# Altium schematic sheet Weather_Station_ETH.SCHDOC
size A4; SheetNumber: 0; SheetTotal: 0
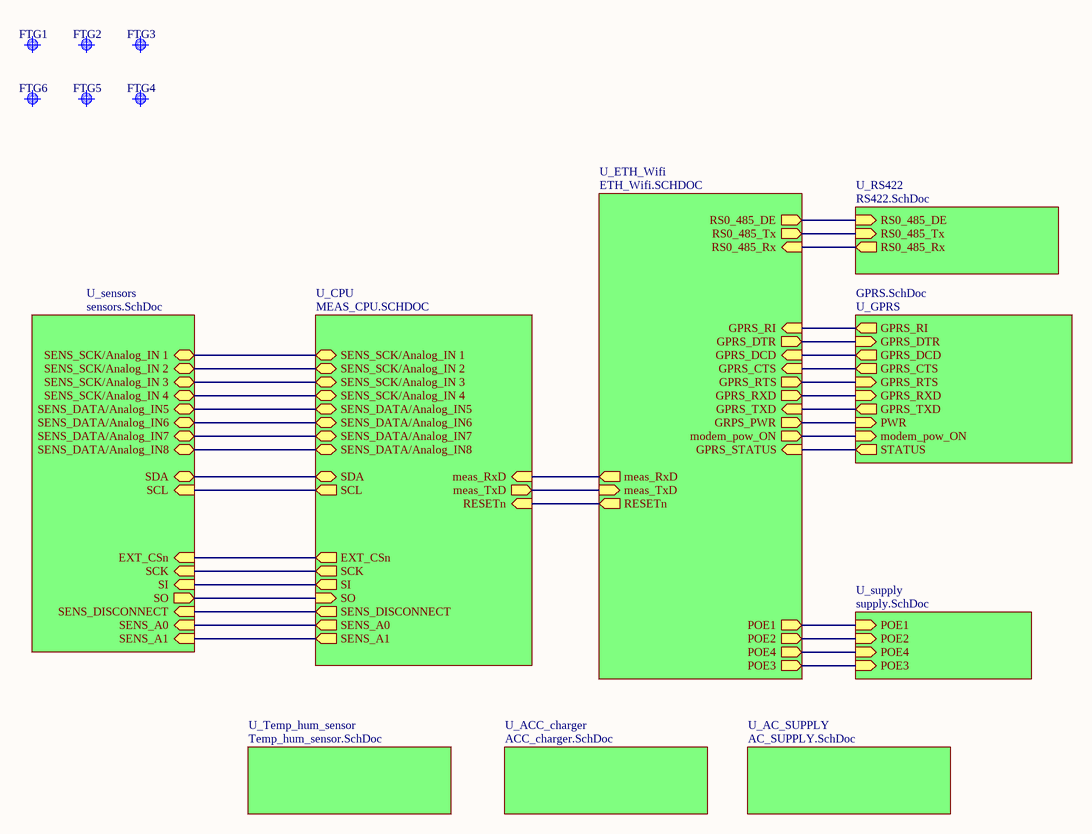
[diagram p0: Weather_Station_ETH.SCHDOC]

## Parts
FTG1  Use only in PCB  [FIDUCIAL_TOP_S100-200]  (value not drawn)
FTG2  Use only in PCB  [FIDUCIAL_TOP_S100-200]  (value not drawn)
FTG3  Use only in PCB  [FIDUCIAL_TOP_S100-200]  (value not drawn)
FTG4  Use only in PCB  [FIDUCIAL_TOP_S100-200]  (value not drawn)
FTG5  Use only in PCB  [FIDUCIAL_TOP_S100-200]  (value not drawn)
FTG6  Use only in PCB  [FIDUCIAL_TOP_S100-200]  (value not drawn)

## Sub-sheets
U_AC_SUPPLY = AC_SUPPLY.SchDoc: no entries
U_ACC_charger = ACC_charger.SchDoc: no entries
U_CPU = MEAS_CPU.SCHDOC: EXT_CSn (out), SI (out), SO (in), SCK (out), SDA (bidir), SCL (out), SENS_A0 (out), SENS_A1 (out), SENS_SCK/Analog_IN 1 (bidir), SENS_SCK/Analog_IN 2 (bidir), SENS_SCK/Analog_IN 3 (bidir), SENS_SCK/Analog_IN 4 (bidir), SENS_DATA/Analog_IN5 (bidir), SENS_DATA/Analog_IN6 (bidir), SENS_DATA/Analog_IN7 (bidir), SENS_DATA/Analog_IN8 (bidir), meas_RxD (in), meas_TxD (out), RESETn (in), SENS_DISCONNECT (out)
U_ETH_Wifi = ETH_Wifi.SCHDOC: POE1 (out), POE2 (out), POE4 (out), POE3 (out), meas_RxD (out), meas_TxD (in), RESETn (out), GPRS_RI (in), GPRS_DTR (out), GPRS_DCD (in), GPRS_CTS (in), GPRS_RTS (out), GPRS_RXD (out), GPRS_TXD (in), GRPS_PWR (out), modem_pow_ON (out), GPRS_STATUS (in), RS0_485_DE (out), RS0_485_Tx (out), RS0_485_Rx (in)
U_GPRS = GPRS.SchDoc: GPRS_DCD (out), GPRS_TXD (out), GPRS_DTR (in), GPRS_RI (out), GPRS_RTS (in), GPRS_RXD (in), GPRS_CTS (out), STATUS (out), PWR (in), modem_pow_ON (in)
U_RS422 = RS422.SchDoc: RS0_485_DE (in), RS0_485_Rx (out), RS0_485_Tx (in)
U_sensors = sensors.SchDoc: SDA (bidir), SCL (in), EXT_CSn (in), SCK (in), SI (in), SO (out), SENS_A0 (in), SENS_A1 (in), SENS_DATA/Analog_IN8 (bidir), SENS_DATA/Analog_IN7 (bidir), SENS_DATA/Analog_IN6 (bidir), SENS_DATA/Analog_IN5 (bidir), SENS_SCK/Analog_IN 4 (bidir), SENS_SCK/Analog_IN 3 (bidir), SENS_SCK/Analog_IN 2 (bidir), SENS_SCK/Analog_IN 1 (bidir), SENS_DISCONNECT (in)
U_supply = supply.SchDoc: POE1 (in), POE2 (in), POE4 (in), POE3 (in)
U_Temp_hum_sensor = Temp_hum_sensor.SchDoc: no entries

## Nets
(unnamed): sheet U_ETH_Wifi/POE1, sheet U_supply/POE1
(unnamed): sheet U_ETH_Wifi/POE2, sheet U_supply/POE2
(unnamed): sheet U_ETH_Wifi/POE4, sheet U_supply/POE4
(unnamed): sheet U_ETH_Wifi/POE3, sheet U_supply/POE3
(unnamed): sheet U_ETH_Wifi/meas_RxD, sheet U_CPU/meas_RxD
(unnamed): sheet U_ETH_Wifi/meas_TxD, sheet U_CPU/meas_TxD
(unnamed): sheet U_ETH_Wifi/RESETn, sheet U_CPU/RESETn
(unnamed): sheet U_ETH_Wifi/GPRS_RI, sheet U_GPRS/GPRS_RI
(unnamed): sheet U_ETH_Wifi/GPRS_DTR, sheet U_GPRS/GPRS_DTR
(unnamed): sheet U_ETH_Wifi/GPRS_DCD, sheet U_GPRS/GPRS_DCD
(unnamed): sheet U_ETH_Wifi/GPRS_CTS, sheet U_GPRS/GPRS_CTS
(unnamed): sheet U_ETH_Wifi/GPRS_RTS, sheet U_GPRS/GPRS_RTS
(unnamed): sheet U_ETH_Wifi/GPRS_RXD, sheet U_GPRS/GPRS_RXD
(unnamed): sheet U_ETH_Wifi/GPRS_TXD, sheet U_GPRS/GPRS_TXD
(unnamed): sheet U_ETH_Wifi/GRPS_PWR, sheet U_GPRS/PWR
(unnamed): sheet U_ETH_Wifi/modem_pow_ON, sheet U_GPRS/modem_pow_ON
(unnamed): sheet U_ETH_Wifi/GPRS_STATUS, sheet U_GPRS/STATUS
(unnamed): sheet U_ETH_Wifi/RS0_485_DE, sheet U_RS422/RS0_485_DE
(unnamed): sheet U_ETH_Wifi/RS0_485_Tx, sheet U_RS422/RS0_485_Tx
(unnamed): sheet U_ETH_Wifi/RS0_485_Rx, sheet U_RS422/RS0_485_Rx
(unnamed): sheet U_sensors/SDA, sheet U_CPU/SDA
(unnamed): sheet U_sensors/SCL, sheet U_CPU/SCL
(unnamed): sheet U_sensors/EXT_CSn, sheet U_CPU/EXT_CSn
(unnamed): sheet U_sensors/SCK, sheet U_CPU/SCK
(unnamed): sheet U_sensors/SI, sheet U_CPU/SI
(unnamed): sheet U_sensors/SO, sheet U_CPU/SO
(unnamed): sheet U_sensors/SENS_A0, sheet U_CPU/SENS_A0
(unnamed): sheet U_sensors/SENS_A1, sheet U_CPU/SENS_A1
(unnamed): sheet U_sensors/SENS_DATA/Analog_IN8, sheet U_CPU/SENS_DATA/Analog_IN8
(unnamed): sheet U_sensors/SENS_DATA/Analog_IN7, sheet U_CPU/SENS_DATA/Analog_IN7
(unnamed): sheet U_sensors/SENS_DATA/Analog_IN6, sheet U_CPU/SENS_DATA/Analog_IN6
(unnamed): sheet U_sensors/SENS_DATA/Analog_IN5, sheet U_CPU/SENS_DATA/Analog_IN5
(unnamed): sheet U_sensors/SENS_SCK/Analog_IN 4, sheet U_CPU/SENS_SCK/Analog_IN 4
(unnamed): sheet U_sensors/SENS_SCK/Analog_IN 3, sheet U_CPU/SENS_SCK/Analog_IN 3
(unnamed): sheet U_sensors/SENS_SCK/Analog_IN 2, sheet U_CPU/SENS_SCK/Analog_IN 2
(unnamed): sheet U_sensors/SENS_SCK/Analog_IN 1, sheet U_CPU/SENS_SCK/Analog_IN 1
(unnamed): sheet U_sensors/SENS_DISCONNECT, sheet U_CPU/SENS_DISCONNECT

## Library data of the parts
FTG1-FTG6 = Fiducial: Fiducial Target; Part Number: FIDUCIAL_TARGET_S100-200; Part Description: Scare Fiducial Target, Top Layer, 1.0mm, Top Sloder 2.0mm, Keepout =2.0mm; Mounted: No; Table: Pads; Component Kind: Standard (No BOM); Component Type: Standard (No BOM); Pin Count: 1; Family: Fiducial; Socket: No; SMD: Yes; Status: None; ComponentHeight: 0mm; Author: CERN DEM JLC; CreateDate: 09.02.2010; LatestRevisionDate: 09.02.2010; PackageDescription: Scare Fiducial Target, Top Layer, 1.0mm, Top Sloder 2.0mm, Keepout =2.0mm